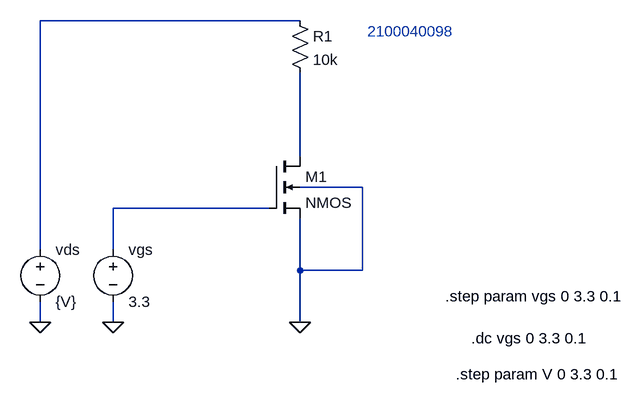
[diagram p0: schematic NMOS transistor characteristic curve test circuit.asc]
NMOS transistor characteristic curve test circuit.asc, the LTspice schematic file:
Version 4
SHEET 1 1020 680
WIRE 464 -176 64 -176
WIRE 464 32 464 -96
WIRE 560 80 464 80
WIRE 416 112 176 112
WIRE 64 176 64 -176
WIRE 176 176 176 112
WIRE 464 208 464 128
WIRE 560 208 560 80
WIRE 560 208 464 208
WIRE 64 288 64 256
WIRE 176 288 176 256
WIRE 464 288 464 208
FLAG 64 288 0
FLAG 176 288 0
FLAG 464 288 0
SYMBOL voltage 64 160 R0
SYMATTR InstName vds
SYMATTR Value {V}
SYMBOL voltage 176 160 R0
SYMATTR InstName vgs
SYMATTR Value 3.3
SYMBOL res 448 -192 R0
SYMATTR InstName R1
SYMATTR Value 10k
SYMBOL nmos4 416 32 R0
SYMATTR InstName M1
TEXT 728 312 Left 2 !.dc vgs 0 3.3 0.1
TEXT 704 368 Left 2 !.step param V 0 3.3 0.1
TEXT 568 -160 Left 2 ;2100040098
TEXT 688 248 Left 2 !.step param vgs 0 3.3 0.1

The netlist it stands for:
* NMOS transistor characteristic curve test circuit.asc
vds N001 0 {V}
vgs N003 0 3.3
R1 N001 N002 10k
M1 N002 N003 0 0 NMOS
.model NMOS NMOS
.model PMOS PMOS
.lib standard.mos
.dc vgs 0 3.3 0.1
.step param V 0 3.3 0.1
* 2100040098
.step param vgs 0 3.3 0.1
.backanno
.end